# Altium schematic sheet 13_Raspberry_Misc.SchDoc: Raspberry Misc
size A3; Organization: Lime Microsystems; Address1: Surrey Tech Centre; Address2: Guildford GU2 7YG; Address3: Surrey; Address4: United Kingdom; DocumentNumber: 12; Revision: v2.1; SheetNumber: 13; SheetTotal: 15; PageSetup: Record=PageOptions|CenterHorizontal=True|CenterVertical=True|PrintScale=1.01|XCorrection=1.00|YCorrection=1.00|PrintKind=0|BorderSize=5000000|LeftOffset=0|BottomOffset=0|Orientation=2|PaperLength=1000|PaperWidth=1000|Scale=100|PaperSource=257|PrintQuality=600|MediaType=1|DitherType=10|PrintScaleMode=1|PaperKind=A3|PaperIndex=8
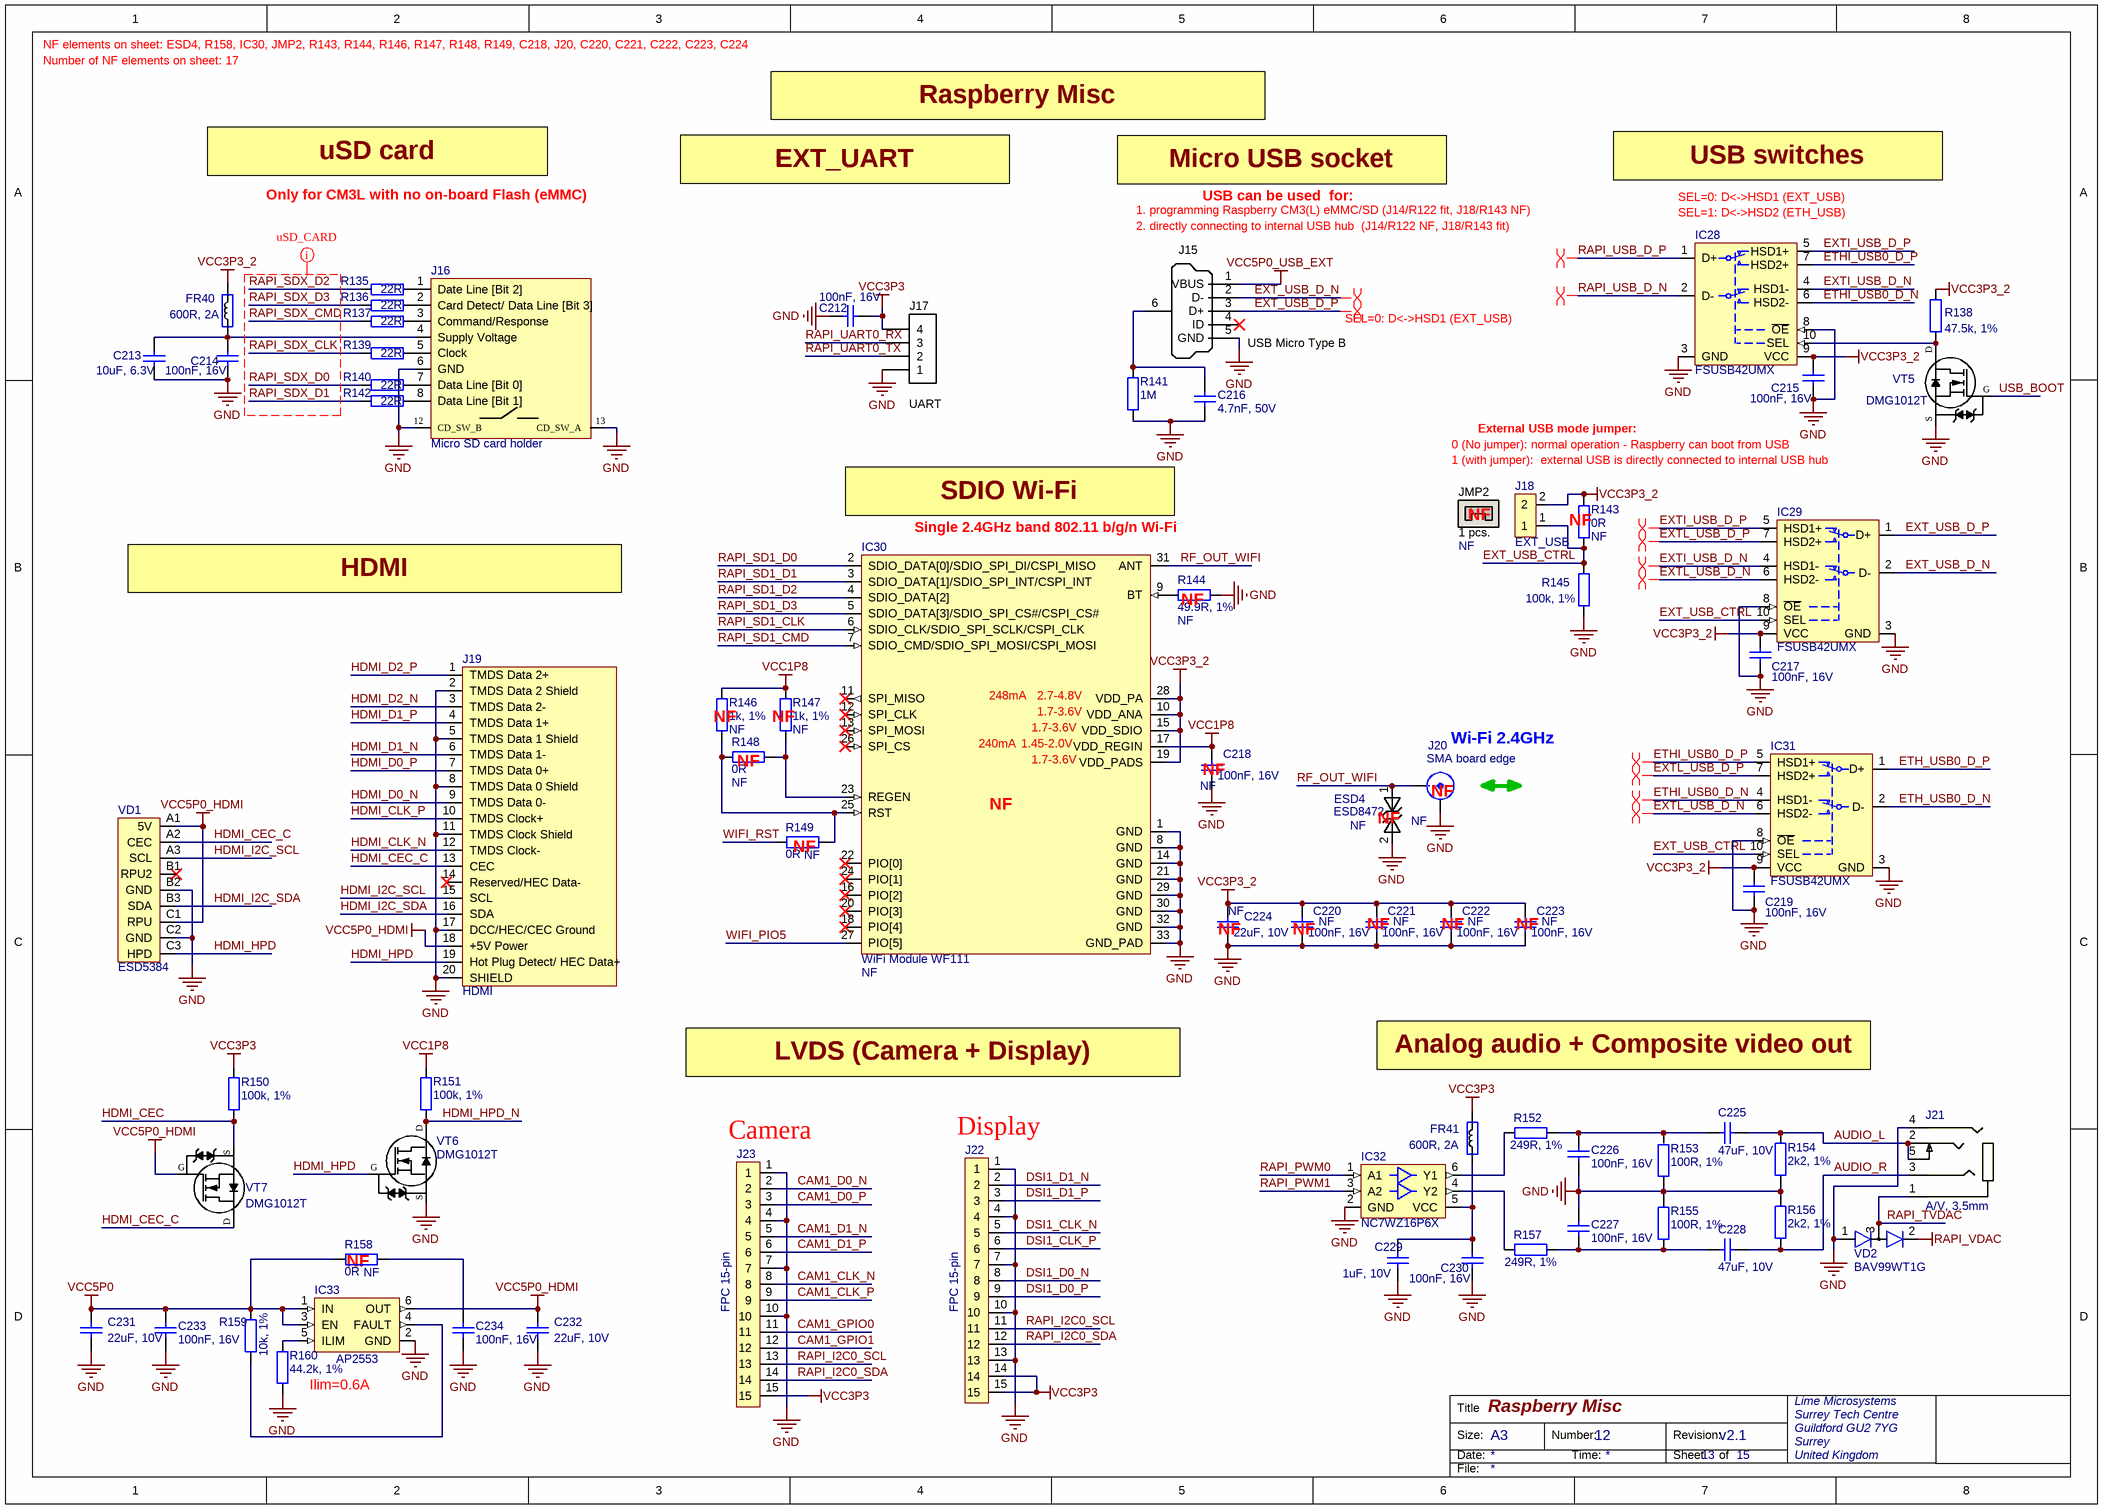
[diagram p0: 13_Raspberry_Misc.SchDoc]

## Parts
C212  100nF, 16V  [CAP0402]
C213  10uF, 6.3V  [CAP0603]
C214  100nF, 16V  [CAP0402]
C215  100nF, 16V  [CAP0402]
C216  4.7nF, 50V  [CAP0402]
C217  100nF, 16V  [CAP0402]
C218  100nF, 16V  Assembly Info: NF  [CAP0402]
C219  100nF, 16V  [CAP0402]
C220  100nF, 16V  Assembly Info: NF  [CAP0402]
C221  100nF, 16V  Assembly Info: NF  [CAP0402]
C222  100nF, 16V  Assembly Info: NF  [CAP0402]
C223  100nF, 16V  Assembly Info: NF  [CAP0402]
C224  22uF, 10V  Assembly Info: NF  [CAP0603]
C225  47uF, 10V  [CAP1206]
C226  100nF, 16V  [CAP0402]
C227  100nF, 16V  [CAP0402]
C228  47uF, 10V  [CAP1206]
C229  1uF, 10V  [CAP0402]
C230  100nF, 16V  [CAP0402]
C231  22uF, 10V  [CAP0603]
C232  22uF, 10V  [CAP0603]
C233  100nF, 16V  [CAP0402]
C234  100nF, 16V  [CAP0402]
ESD4  ESD8472  Assembly Info: NF  [ESD8472_X3DFN2]
FR40  600R, 2A  [RES0805]
FR41  600R, 2A  [RES0805]
IC28  FSUSB42UMX  [FSUSB42UMX]
IC29  FSUSB42UMX  [FSUSB42UMX]
IC30  WiFi Module WF111  Assembly Info: NF  [WF111-A-V1_WIFI]
IC31  FSUSB42UMX  [FSUSB42UMX]
IC32  NC7WZ16P6X  [SC-70_NC7WZ16P6X]
IC33  AP2553  [SOT23-6]
J15  USB Micro Type B  [microUSB_v2]
J16  Micro SD card holder  [MICRO_SD_CARD_114-00841-68_v2]
J17  UART  [HEADER4X1_TH]
J18  EXT_USB  [HDR_1x2]
J19  HDMI  [HDMI_AMPHENOL_10029449-111RLF]
J20  SMA board edge  Assembly Info: NF  [SMA_connector_board_edge_SM]
J21  A/V, 3.5mm  [Audio_jack_3.5mm]
J22  FPC 15-pin  [FPC_CONNECTOR_15pin_1-1734248-5]
J23  FPC 15-pin  [FPC_CONNECTOR_15pin_1-1734248-5]
JMP2  1 pcs.  Assembly Info: NF  (mechanical)
R135  22R  [RES0402]
R136  22R  [RES0402]
R137  22R  [RES0402]
R138  47.5k, 1%  [RES0402]
R139  22R  [RES0402]
R140  22R  [RES0402]
R141  1M  [RES0402]
R142  22R  [RES0402]
R143  0R  Assembly Info: NF  [RES0402]
R144  49.9R, 1%  Assembly Info: NF  [RES0402]
R145  100k, 1%  [RES0402]
R146  1k, 1%  Assembly Info: NF  [RES0402]
R147  1k, 1%  Assembly Info: NF  [RES0402]
R148  0R  Assembly Info: NF  [RES0402]
R149  0R  Assembly Info: NF  [RES0402]
R150  100k, 1%  [RES0402]
R151  100k, 1%  [RES0402]
R152  249R, 1%  [RES0402]
R153  100R, 1%  [RES0402]
R154  2k2, 1%  [RES0402]
R155  100R, 1%  [RES0402]
R156  2k2, 1%  [RES0402]
R157  249R, 1%  [RES0402]
R158  0R  Assembly Info: NF  [RES0402_v2]
R159  10k, 1%  [RES0402]
R160  44.2k, 1%  [RES0402]
VD1  ESD5384  [TVS_ESD5384NCTBG]
VD2  BAV99WT1G  [SC-70_BAV99WT1G]
VT5  DMG1012T  [SOT523]
VT6  DMG1012T  [SOT523]
VT7  DMG1012T  [SOT523]

## Nets
GND: C212.2 C213.1 C214.2 C215.2 C216.2 C217.2 C218.1 C219.2 C220.1 C221.1 C222.1 C223.1 C224.1 C226.2 C227.1 C229.1 C230.2 C231.1 C232.1 C233.2 C234.2 ESD4.2 IC28.3(GND) IC28.8(~{OE}) IC29.3(GND) IC29.8(~{OE}) IC30.1(GND) IC30.8(GND) IC30.14(GND) IC30.21(GND) IC30.29(GND) IC30.30(GND) IC30.32(GND) IC30.33(GND_PAD) IC31.3(GND) IC31.8(~{OE}) IC32.2(GND) IC33.2(GND) J15.5(GND) J16.6(GND) J16.12(CD_SW_B) J16.13(CD_SW_A) J17.1 J19.2(TMDS_Data_2_Shield) J19.5(TMDS_Data_1_Shield) J19.8(TMDS_Data_0_Shield) J19.11(TMDS_Clock_Shield) J19.17(DCC/HEC/CEC_Ground) J19.20(SHIELD) J20.2(Y) J21.4 J22.1 J22.4 J22.7 J22.10 J22.13 J23.1 J23.4 J23.7 J23.10 R141.2 R144.1 R145.2 R153.1 R154.2 R155.2 R156.1 R160.2 VD1.B2(GND) VD1.C2(GND) VD2.1 VT5.S VT6.S
RAPI_VDAC: VD2.2
VCC1P8: C218.2 IC30.17(VDD_REGIN) R146.1 R147.1 R151.1
VCC3P3: C212.1 FR41.2 J17.4 J22.14 J22.15 J23.15 R150.1
VCC3P3_2: C215.1 C217.1 C219.1 C220.2 C221.2 C222.2 C223.2 C224.2 FR40.2 IC28.9(VCC) IC29.9(VCC) IC30.10(VDD_ANA) IC30.15(VDD_SDIO) IC30.19(VDD_PADS) IC30.28(VDD_PA) IC31.9(VCC) J18.2 R138.1 R143.2
VCC5P0: C231.2 C233.1 IC33.1(IN) IC33.3(EN) R158.2 R159.1
VCC5P0_HDMI: C232.2 C234.1 IC33.6(OUT) J19.18(+5V_Power) R158.1 VD1.A1(5V) VD1.C1(RPU) VT7.G
VCC5P0_USB_EXT: J15.1(VBUS)
AUDIO_L: C225.1 J21.2 J21.5 R154.1
AUDIO_R: C228.1 J21.3 R156.2
CAM1_CLK_N: J23.8
CAM1_CLK_P: J23.9
CAM1_D0_N: J23.2
CAM1_D0_P: J23.3
CAM1_D1_N: J23.5
CAM1_D1_P: J23.6
CAM1_GPIO0: J23.11
CAM1_GPIO1: J23.12
DSI1_CLK_N: J22.5
DSI1_CLK_P: J22.6
DSI1_D0_N: J22.8
DSI1_D0_P: J22.9
DSI1_D1_N: J22.2
DSI1_D1_P: J22.3
ETH_USB0_D_N: IC31.2(D-)
ETH_USB0_D_P: IC31.1(D+)
ETHI_USB0_D_N: IC28.6(HSD2-) IC31.4(HSD1-)
ETHI_USB0_D_P: IC28.7(HSD2+) IC31.5(HSD1+)
EXT_USB_CTRL: IC29.10(SEL) IC31.10(SEL) J18.1 R143.1 R145.1
EXT_USB_D_N: IC29.2(D-) J15.2(D-)
EXT_USB_D_P: IC29.1(D+) J15.3(D+)
EXTI_USB_D_N: IC28.4(HSD1-) IC29.4(HSD1-)
EXTI_USB_D_P: IC28.5(HSD1+) IC29.5(HSD1+)
EXTL_USB_D_N: IC29.6(HSD2-) IC31.6(HSD2-)
EXTL_USB_D_P: IC29.7(HSD2+) IC31.7(HSD2+)
HDMI_CEC: R150.2 VT7.S
HDMI_CEC_C: J19.13(CEC) VD1.A2(CEC) VT7.D
HDMI_CLK_N: J19.12(TMDS_Clock-)
HDMI_CLK_P: J19.10(TMDS_Clock+)
HDMI_D0_N: J19.9(TMDS_Data_0-)
HDMI_D0_P: J19.7(TMDS_Data_0+)
HDMI_D1_N: J19.6(TMDS_Data_1-)
HDMI_D1_P: J19.4(TMDS_Data_1+)
HDMI_D2_N: J19.3(TMDS_Data_2-)
HDMI_D2_P: J19.1(TMDS_Data_2+)
HDMI_HPD: J19.19(Hot_Plug_Detect/_HEC_Data+) VD1.C3(HPD) VT6.G
HDMI_HPD_N: R151.2 VT6.D
HDMI_I2C_SCL: J19.15(SCL) VD1.A3(SCL)
HDMI_I2C_SDA: J19.16(SDA) VD1.B3(SDA)
RAPI_I2C0_SCL: J22.11 J23.13
RAPI_I2C0_SDA: J22.12 J23.14
RAPI_PWM0: IC32.1(A1)
RAPI_PWM1: IC32.3(A2)
RAPI_SD1_CLK: IC30.6(SDIO_CLK/SDIO_SPI_SCLK/CSPI_CLK)
RAPI_SD1_CMD: IC30.7(SDIO_CMD/SDIO_SPI_MOSI/CSPI_MOSI)
RAPI_SD1_D0: IC30.2(SDIO_DATA[0]/SDIO_SPI_DI/CSPI_MISO)
RAPI_SD1_D1: IC30.3(SDIO_DATA[1]/SDIO_SPI_INT/CSPI_INT)
RAPI_SD1_D2: IC30.4(SDIO_DATA[2])
RAPI_SD1_D3: IC30.5(SDIO_DATA[3]/SDIO_SPI_CS#/CSPI_CS#)
RAPI_SDX_CLK: R139.1
RAPI_SDX_CMD: R137.1
RAPI_SDX_D0: R140.1
RAPI_SDX_D1: R142.1
RAPI_SDX_D2: R135.1
RAPI_SDX_D3: R136.1
RAPI_TVDAC: J21.1 VD2.3
RAPI_UART0_RX: J17.3
RAPI_UART0_TX: J17.2
RAPI_USB_D_N: IC28.2(D-)
RAPI_USB_D_P: IC28.1(D+)
RF_OUT_WIFI: ESD4.1 IC30.31(ANT) J20.1(X)
USB_BOOT: VT5.G
WIFI_PIO5: IC30.27(PIO[5])
WIFI_RST: R149.1
NetC213_2: C213.2 C214.1 FR40.1 J16.4(Supply_Voltage)
NetC216_1: C216.1 J15.6(Shell) R141.1
NetC225_2: C225.2 C226.1 R152.2 R153.2
NetC227_2: C227.2 C228.2 R155.1 R157.2
NetC229_2: C229.2 C230.1 FR41.1 IC32.5(VCC)
NetIC28_10: IC28.10(SEL) R138.2 VT5.D
NetIC30_9: IC30.9(BT) R144.2
NetIC30_23: IC30.23(REGEN) R147.2 R148.2
NetIC30_25: IC30.25(RST) R146.2 R148.1 R149.2
NetIC32_4: IC32.4(Y2) R157.1
NetIC32_6: IC32.6(Y1) R152.1
NetIC33_4: IC33.4(FAULT) R159.2
NetIC33_5: IC33.5(ILIM) R160.1
NetJ16_1: J16.1(Date_Line_[Bit_2]) R135.2
NetJ16_2: J16.2(Card_Detect/_Data_Line_[Bit_3]) R136.2
NetJ16_3: J16.3(Command/Response) R137.2
NetJ16_5: J16.5(Clock) R139.2
NetJ16_7: J16.7(Data_Line_[Bit_0]) R140.2
NetJ16_8: J16.8(Data_Line_[Bit_1]) R142.2

Not connected (* = marked no-connect by the designer): IC30 11(SPI_MISO)* 12(SPI_CLK)* 13(SPI_MOSI)* 16(PIO[2])* 18(PIO[4])* 20(PIO[3])* 22(PIO[0])* 24(PIO[1])* 26(SPI_CS)*; J15 4(ID)*; J19 14(Reserved/HEC_Data-)*; JMP2 1 2; VD1 B1(RPU2)*

## Layout directives
net class uSD_CARD: RAPI_SDX_CLK, RAPI_SDX_CMD, RAPI_SDX_D0, RAPI_SDX_D1, RAPI_SDX_D2, RAPI_SDX_D3
differential pair: ETHI_USB0_D_N, ETHI_USB0_D_P, EXT_USB_D_N, EXT_USB_D_P, EXTI_USB_D_N, EXTI_USB_D_P, EXTL_USB_D_N, EXTL_USB_D_P, RAPI_USB_D_N, RAPI_USB_D_P

## Notes on the sheet
- Number of NF elements on sheet: 17
- NF elements on sheet: ESD4, R158, IC30, JMP2, R143, R144, R146, R147, R148, R149, C218, J20, C220, C221, C222, C223, C224
- Raspberry Misc
- uSD card
- EXT_UART
- Micro USB socket
- USB switches
- Only for CM3L with no on-board Flash (eMMC)
- (near J15) 2. directly connecting to internal USB hub  (J14/R122 NF, J18/R143 fit)
- 1. programming Raspberry CM3(L) eMMC/SD (J14/R122 fit, J18/R143 NF)
- USB can be used  for:
- (near IC28) SEL=0: D<->HSD1 (EXT_USB)
- (near IC28) SEL=1: D<->HSD2 (ETH_USB)
- SEL=0: D<->HSD1 (EXT_USB)
- 0 (No jumper): normal operation - Raspberry can boot from USB
- External USB mode jumper:
- SDIO Wi-Fi
- 1 (with jumper):  external USB is directly connected to internal USB hub
- (near JMP2) NF
- HDMI
- (near IC30) Single 2.4GHz band 802.11 b/g/n Wi-Fi
- (near R143) NF
- (near R144) NF
- (near R146) NF
- (near R147) NF
- (near IC30) 248mA
- (near IC30) 2.7-4.8V
- (near IC30) 1.7-3.6V
- (near R148) NF
- (near IC30) 240mA
- (near IC30) 1.45-2.0V
- (near C218) NF
- (near J20) Wi-Fi 2.4GHz
- (near R149) NF
- (near IC30) NF
- (near ESD4) NF
- (near J20) NF
- (near C221) NF
- (near C222) NF
- (near C223) NF
- (near C224) NF
- (near C220) NF
- LVDS (Camera + Display)
- Analog audio + Composite video out
- (near J23) Camera
- (near J22) Display
- (near R158) NF
- Ilim=0.6A
- Title
- Size:
- Date:
- A3
- Number:
- Time:
- Revision:
- Sheet
- of
- File:

## Library data of the parts
C212 C214 = Cap_0603: Manufacturer Part Number 1: GRM155R71C104KA88D; Part Description: CAP CER 0.1UF 16V X7R 0402; Brand: Murata Electronics; Tolerance: 10 %; Type: General Purpose MLCC; Capacitance: 0.1 uF; Temperature Coefficient / Code: +/- 15 %; Supplier 1: Mouser; Supplier Part Number 1: 81-GRM155R71C104KA88; Case Code - in: 0402; Manufacturer: Murata Electronics; Category: Multilayer Ceramic Capacitors MLCC - SMD/SMT; Voltage Rating DC: 16 V; Value: 100nF, 16V; Maximum Operating Temperature: + 125 C; Minimum Operating Temperature: - 55 C; Minimum Order Quantity: 1; Operating Temperature Range: - 55 C to + 125 C; Package / Case: 0402 (1005 metric); Packaging: Reel; Product: General Type MLCCs; Product Category: Low & Medium Capacitance SMD Ceramic Chip Capacitors; Reeling: True; RoHS - Mouser: Y; RoHS: RoHS Compliant; Series: GRM; Standard Pack Qty: 10000; Termination Style: SMD/SMT
C213 = Cap_0603: Manufacturer Part Number 1: CC0603MRX5R5BB106; Manufacturer: Yageo; Part Description: 10µF ±20% 6.3V X5R Ceramic Capacitor -55°C ~ 85°C Surface Mount, MLCC 0603 (1608 Metric) 0.063" L x 0.031" W (1.60mm x 0.80mm); Capacitance: 10µF; Tolerance: ±20%; Supplier 1: Digi-Key; Supplier Part Number 1: 311-1448-2-ND; Package / Case: 0603 (1608 Metric); Category: Capacitors; Voltage - Rated: 6.3V; Value: 10uF, 6.3V
C215 C217-C223 C226 C227 C230 C233 C234 = Cap_0402: Manufacturer: Murata Electronics; Manufacturer Part Number: GRM155R71C104KA88D; Part Description: CAP CER 0.1UF 16V X7R 0402; Tolerance: 10 %; Type: General Purpose MLCC; Capacitance: 0.1 uF; Case Length: 1 mm; Dielectric: X7R; Case Height: 0.5 mm; Temperature Coefficient / Code: +/- 15 %; Value: 100nF, 16V; Supplier 1: Mouser; Supplier Part Number 1: 81-GRM155R71C104KA88; Case Code - in: 0402; RoHS: RoHS Compliant; Operating Temperature Range: - 55 C to + 125 C; Series: GRM; Termination Style: SMD/SMT; Package / Case: 0402 (1005 metric); Voltage Rating DC: 16 V; Maximum Operating Temperature: + 125 C; Case Code - mm: 1005; Minimum Operating Temperature: - 55 C; Product Category: Low & Medium Capacitance SMD Ceramic Chip Capacitors; Packaging: Reel; Product: General Type MLCCs; Category: Multilayer Ceramic Capacitors MLCC - SMD/SMT; Brand: Murata Electronics; Case Width: 0.5 mm; RoHS - Mouser: Y; Standard Pack Qty: 10000; Minimum Order Quantity: 1; Reeling: True; Manufacturer Part Number 1: GRM155R71C104KA88D
C216 = Cap_0402: Manufacturer: Murata Electronics North America; Manufacturer Part Number 1: GCM155R71H472KA37D; Part Description: 4700pF ±10% 50V Ceramic Capacitor X7R 0402 (1005 Metric); Tolerance: ±10%; Temperature Coefficient: X7R; Voltage - Rated: 50V; Packaging: Cut Tape (CT); Operating Temperature: -55°C ~ 125°C; Package / Case: 0402 (1005 Metric); Thickness (Max): 0.022" (0.55mm); Features: -; Supplier Part Number 1: 490-4915-1-ND; Ratings: AEC-Q200; Applications: Automotive; Size / Dimension: 0.039" L x 0.020" W (1.00mm x 0.50mm); Part Status: Active; Lead Spacing: -; Lead Style: -; Supplier 1: Digi-Key; Height - Seated (Max): -; Mounting Type: Surface Mount, MLCC; RoHS: RoHS Compliant; Category: Capacitors; Value: 4.7nF, 50V
C224 C231 C232 = Cap_0603: Manufacturer Part Number 1: C1608X5R1A226M080AC; Manufacturer: TDK Corporation; Part Description: 22µF ±20% 10V X5R Ceramic Capacitor -55°C ~ 85°C Surface Mount, MLCC 0603 (1608 Metric) 0.063" L x 0.031" W (1.60mm x 0.80mm); Brand: TDK; Temperature Coefficient / Code: +/- 15 %; Tolerance: 20 %; Type: Multilayer Ceramic Chip Capacitor; Supplier 1: Mouser; Supplier Part Number 1: 810-C1608X5R1A226M; Package / Case: 0603 (1608 metric); Category: Multilayer Ceramic Capacitors MLCC - SMD/SMT; Capacitance: 22 uF; Operating Temperature Range: - 55 C to + 85 C; Case Code - in: 0603; Voltage Rating DC: 10 V; Case Code - mm: 1608; Value: 22uF, 10V
C225 C228 = Cap_1206: Manufacturer: TDK Corporation; Manufacturer Part Number 1: C3216X6S1A476M160AC; Part Description: 47µF ±20% 10V Ceramic Capacitor X6S 1206 (3216 Metric); Notification: Current market demand for these product types have resulted in fluctuating and extending lead times. Lead times may differ.; Tolerance: ±20%; Temperature Coefficient: X6S; Value: 47uF, 10V; RoHS: RoHS Compliant; Packaging: Cut Tape (CT); Operating Temperature: -55°C ~ 105°C; Voltage - Rated: 10V; Height - Seated (Max): -; Ratings: -; Applications: General Purpose; Features: Low ESL; Size / Dimension: 0.126" L x 0.063" W (3.20mm x 1.60mm); Supplier 1: Digi-Key; Lead Spacing: -; Supplier Part Number 1: 445-6010-1-ND; Thickness (Max): 0.071" (1.80mm); Failure Rate: -; Category: Capacitors; Lead Style: -; Part Status: Active; Mounting Type: Surface Mount, MLCC; Package / Case: 1206 (3216 Metric)
C229 = Cap_0402: CAP CER 1UF 10V X5R 0402; Manufacturer: Yageo; Part Description: 1µF 10V Ceramic Capacitor X5R 0402 (1005 Metric) 0.039" L x 0.020" W (1.00mm x 0.50mm); Manufacturer Part Number 1: CC0402MRX5R6BB105; Notification: Current market demand for these product types have resulted in fluctuating and extending lead times. Lead times may differ.; Tolerance: ±20%; Value: 1uF, 10V; Supplier 1: Digi-Key; Supplier Part Number 1: 311-1732-1-ND; RoHS: RoHS Compliant; Applications: General Purpose; Category: Capacitors; ComponentLink1Description: http://www.yageo.com/documents/recent/UPY-GPHC_X5R_4V-to-50V_25.pdf; ComponentLink1URL: http://www.yageo.com/documents/recent/UPY-GPHC_X5R_4V-to-50V_25.pdf; Failure Rate: -; Features: -; Height - Seated (Max): -; Lead Spacing: -; Lead Style: -; Mounting Type: Surface Mount, MLCC; Operating Temperature: -55°C ~ 85°C; Package / Case: 0402 (1005 Metric); Packaging: Cut Tape (CT); Part Status: Active; Pricing 1: 1=0.22, 10=0.156, 100=0.0732, 500=0.0513, 1000=0.04248, 2500=0.03953, 5000=0.03617 (USD); Ratings: -; Size / Dimension: 0.039" L x 0.020" W (1.00mm x 0.50mm); Stock 1: 69600; Temperature Coefficient: X5R; Thickness (Max): 0.022" (0.55mm); Voltage - Rated: 10V
ESD4 = ESD8472: Manufacturer: ON Semiconductor; Manufacturer Part Number 1: ESD8472MUT5G; Part Description: TVS DIODE 5.3VWM 14VC X3DFN2; Voltage - Reverse Standoff (Typ): 5.3V (Max); Voltage - Breakdown (Min): 7V; Voltage - Clamping (Max) @ Ipp: 14V; Current - Peak Pulse (10/1000µs): 3A (8/20µs); Power Line Protection: No; Capacitance @ Frequency: 0.2pF @ 1MHz; Supplier 1: Digi-Key; RoHS: RoHS Compliant; Category: Circuit Protection; Stock 1: 2295; Pricing 1: 1=0.39, 10=0.315, 100=0.2142, 500=0.16068, 1000=0.12051 (USD); Packaging: Cut Tape (CT); Part Status: Active; Type: Zener; Power - Peak Pulse: -; Applications: Automotive, RF Antenna; Operating Temperature: -55°C ~ 150°C (TJ); Mounting Type: Surface Mount; Package / Case: 2-XFDFN; Supplier Device Package: 2-X3DFN (0.62x0.32); ComponentLink1URL: http://www.onsemi.com/pub/Collateral/ESD8472-D.PDF; ComponentLink1Description: http://www.onsemi.com/pub/Collateral/ESD8472-D.PDF; Supplier Part Number 1: ESD8472MUT5GOSCT-ND
FR40 FR41 = Ferrite: Manufacturer Part Number 1: MPZ2012S601AT000; Manufacturer: TDK Corporation; Part Description: FERRITE BEAD 600 OHM 0805 1LN; Filter Type: Differential Mode - Single; Impedance @ Frequency: 600 Ohm @ 100MHz; DC Resistance (DCR): 100 mOhm Max; Supplier 1: Digi-Key; Supplier Part Number 1: 445-2206-2-ND; Mounting Type: Surface Mount; RoHS: RoHS Compliant; Height (Max): 0.041" (1.05mm); Packaging: Tape & Reel (TR); Category: Filters; Current Rating: 2A; Package / Case: 0805 (2012 Metric); Size / Dimension: 0.079" L x 0.049" W (2.00mm x 1.25mm)
IC28 IC29 IC31 = FSUSB42UMX: Part Description: USB Switch IC 1 Channel 10-UMLP (1.8x1.4); Manufacturer: ON Semiconductor; Switch Circuit: DPDT; On-State Resistance (Max): 6.5 Ohm; Voltage - Supply, Single (V+): 2.4 V ~ 4.4 V; -3db Bandwidth: 720MHz; Supplier 1: Digi-Key; Manufacturer Part Number 1: FSUSB42UMX; RoHS: RoHS Compliant; Category: Integrated Circuits (ICs); Stock 1: 8344; Pricing 1: 1=0.59, 10=0.502, 100=0.3749, 500=0.29458, 1000=0.22763 (USD); Packaging: Cut Tape (CT); Part Status: Active; Applications: USB; Multiplexer/Demultiplexer Circuit: -; Voltage - Supply, Dual (V±): -; Features: Break-Before-Make, USB 2.0; Operating Temperature: -40°C ~ 85°C (TA); Package / Case: 10-UFQFN; Supplier Device Package: 10-UMLP (1.8x1.4); Base Part Number: FSUSB42; ComponentLink1URL: https://www.fairchildsemi.com/datasheets/FS/FSUSB42.pdf; ComponentLink1Description: https://www.fairchildsemi.com/datasheets/FS/FSUSB42.pdf; Supplier Part Number 1: FSUSB42UMXCT-ND
IC30 = WF111-A-V1_WIFI: Manufacturer: Bluegiga Technologies; Part Description: RF TXRX MODULE WIFI CHIP ANT; Data Rate: 72200Kbps; Number of Channels: 13; Operating Supply Voltage: 3.3V; Max Frequency: 2.472GHz; Supplier 1: Digi-Key; Manufacturer Part Number 1: WF111-A-V1; Stock 1: 1144; Pricing 1: 1=10.23, 25=9.8484, 100=9.4695 (USD); Mount: Surface Mount; Number of Pins: 33; Min Operating Temperature: -40°C; Max Operating Temperature: 85°C; Supplier Part Number 1: 1446-1031-6-ND
IC32 = NC7WZ16P6X_DUAL_BUFFER: Manufacturer: ON Semiconductor / Fairchild; Part Description: Buffer, Non-Inverting 2 Element 1 Bit per Element Push-Pull Output SC-70-6; Min Supply Voltage: 1.65V; Max Supply Voltage: 5.5V; Number of Channels: 2; Propagation Delay: 3.8ns; Logic Function: Buffer,Inverting; Max Power Dissipation: 180mW; Low Level Output Current: 32mA; Polarity: Non-Inverting; Number of Bits per Element: 1; High Level Output Current: -32mA; Turn-On Delay Time: 10.6ns; Quiescent Current: 1uA; Supplier 1: Digi-Key; Manufacturer Part Number 1: NC7WZ16P6X; Stock 1: 0; Mount: Surface Mount; Case/Package: SC; Number of Pins: 6; Weight: 0.028g; Contact Plating: Matte,Tin; Min Operating Temperature: -40°C; Max Operating Temperature: 125°C; Number of Inputs: 2; Number of Outputs: 2; Packaging: Tape and Reel; Package Quantity: 3000; Number of Elements: 2; Number of Input Lines: 2; Number of Output Lines: 2; Termination: SMD/SMT; Number of Circuits: 2; Number of Bits: 2; Length: 2mm; Height: 1mm; Width: 1.25mm; Radiation Hardening: No; REACH SVHC: No SVHC; Lead Free: Lead Free; Supplier Part Number 1: NC7WZ16P6XDKR-ND
IC33 = AP2553W6-7: Manufacturer: Diodes; Part Description: IC PD SW CURR LIMIT SOT26; Number of Outputs: 1; Min Supply Voltage: 2.7V; Max Supply Voltage: 5.5V; Interface: On/Off; Max Output Current: 2.1A; Turn-Off Delay Time: 500us; On-State Resistance: 70mR; Turn-On Delay Time: 1.5ms; Power Rating: 340mW; Fault Protection: Over Temperature,Reverse Current; Output Configuration: High Side; Supplier 1: Digi-Key; Manufacturer Part Number 1: AP2553W6-7; Stock 1: 53805; Pricing 1: 1=0.5, 10=0.425, 100=0.3172, 500=0.24926, 1000=0.19261 (USD); Mount: Surface Mount; Case/Package: SOT-26; Number of Pins: 6; Min Operating Temperature: -40°C; Max Operating Temperature: 85°C; Package Quantity: 3000; Packaging: Tape and Reel; Voltage: 5.5V; Current: 2.1A; Length: 3.1mm; Height: 1.3mm; Width: 1.7mm; Radiation Hardening: No; Lead Free: Lead Free; REACH SVHC: No SVHC; Supplier Part Number 1: AP2553W6-7DIDKR-ND
J15 = USB_Micro_TypeB: Connector SMD USB Micro Type B; Part Description: CONN USB MICRO B RECPT SMT R/A; Manufacturer Part Number 1: 10118193-0001LF; Manufacturer: Amphenol FCI; Connector Type: USB - micro B; Number of Contacts: 5; Supplier 1: Digi-Key; Category: Connectors, Interconnects; Mounting Type: Surface Mount, Right Angle, Horizontal; Supplier Part Number 1: 609-4616-2-ND
J16 = MICRO_SD_114-00841-68: Manufacturer: Amphenol Commercial Products; Part Description: 10 (8 + 2) Position Card Connector Secure Digital - microSD™ Surface Mount, Right Angle Gold; Card Type: Secure Digital - microSD™; Number of Positions: 10 (8 + 2); Connector Type: Connector; Insertion, Removal Method: Push In, Pull Out; Supplier 1: Digi-Key; Manufacturer Part Number 1: 114-00841-68; RoHS: RoHS Compliant; Category: Connectors, Interconnects; Stock 1: 5866; Pricing 1: 1=1.5, 10=1.358, 25=1.2752, 50=1.2196, 100=1.1642, 250=1.05336, 500=0.9702 (USD); Packaging: Cut Tape (CT); Part Status: Active; Ejector Side: -; Mounting Type: Surface Mount, Right Angle; Features: Switch; Height Above Board: 0.061" (1.55mm); Mounting Feature: Normal, Standard - Top; Contact Finish: Gold; Contact Finish Thickness: 15.0µin (0.38µm); ComponentLink1URL: https://www.amphenolcanada.com/ProductSearch/drawings/AC/1140084168.pdf; ComponentLink1Description: https://www.amphenolcanada.com/ProductSearch/drawings/AC/1140084168.pdf; Supplier Part Number 1: 114-00841-68-1-ND
J17 = Header4P: Header, 4-pin; Part Description: 4 Positions Header Connector 0.100" (2.54mm) Through Hole Gold; Manufacturer: Wurth Electronics Inc.; Manufacturer Part Number 1: 61300411121; Pitch - Mating: 0.100" (2.54mm); Number of Positions: 4; Number of Positions Loaded: All; Style: Board to Board or Cable; Shrouding: Unshrouded; Contact Length - Mating: 0.236" (6.00mm); Contact Length - Post: 0.118" (3.00mm); Overall Contact Length: 0.454" (11.54mm); Material Flammability Rating: UL94 V-0; Current Rating: 3A; Voltage Rating: 250V; Supplier 1: Digi-Key; Supplier Part Number 1: 732-5317-ND; RoHS: RoHS Compliant; Category: Connectors, Interconnects; Stock 1: 25204; Pricing 1: 1=0.18, 10=0.153, 25=0.1272, 50=0.106, 100=0.096, 1000=0.088 (USD); Packaging: Bulk; Part Status: Active; Connector Type: Header; Contact Type: Male Pin; Number of Rows: 1; Row Spacing - Mating: -; Mounting Type: Through Hole; Termination: Solder; Fastening Type: Push-Pull; Insulation Height: 0.100" (2.54mm); Contact Shape: Square; Contact Finish - Mating: Gold; Contact Finish Thickness - Mating: -; Contact Finish - Post: -; Contact Material: Copper Alloy; Insulation Material: Polybutylene Terephthalate (PBT); Features: -; Operating Temperature: -40°C ~ 125°C; Ingress Protection: -; Insulation Color: Black; Mated Stacking Heights: -; Contact Finish Thickness - Post: -; Applications: -; ComponentLink1URL: http://katalog.we-online.de/em/datasheet/6130xx11121.pdf; ComponentLink1Description: http://katalog.we-online.de/em/datasheet/6130xx11121.pdf
J18 = Jumper: Manufacturer Part Number 1: 961102-6404-AR; Part Description: 2 Positions Header, Unshrouded Connector 0.100" (2.54mm) Through Hole Gold; Manufacturer: 3M; Connector Type: Header, Unshrouded; Supplier 1: Digi-Key; Supplier Part Number 1: 3M9447-ND; Contact Type: Male Pin; Color: Black; Mounting Type: Through Hole; Category: Connectors, Interconnects; Contact Finish: Gold
J19 = HDMI_AMPHENOL_10029449-111RLF: Manufacturer: Amphenol FCI; Part Description: HDMI HDMI™ 1.4 Receptacle Connector 19 Position Surface Mount, Right Angle; Through Hole; Body Material: Stainless Steel; Gender: Receptacle; Voltage Rating: 40V; Number of Contacts: 19; Insulation Resistance: 100MR; Number of Ports: 1; Pitch: 0.5mm; Supplier 1: Mouser; Manufacturer Part Number 1: 10029449-111RLF; Stock 1: 4435; Pricing 1: 1=0.72, 10=0.661, 50=0.525, 100=0.503, 1000=0.367, 10000=0.325 (USD); Mount: Horizontal,Surface Mount; Contact Material: Bronze,Copper Alloy; Contact Plating: Gold; Colour: Black; Number of Terminals: 19; Housing Material: Thermoplastic; Min Operating Temperature: -55°C; Max Operating Temperature: 85°C; Package Quantity: 400; Packaging: Tape and Reel; Connector Type: HDMI; Number of Positions: 19; Termination: Solder; Max Voltage Rating (AC): 40V; Orientation: Right Angle; Features: Shielded; Length: 15.7mm; Depth: 9.5mm; Radiation Hardening: No; REACH SVHC: No SVHC; Lead Free: Lead Free; Supplier Part Number 1: 649-10029449-111RLF
J20 = RF_IF_connector: CONN SMA JACK STR 50OHM EDGE MNT; Manufacturer: RF Solutions; Manufacturer Part Number 1: CON-SMA-EDGE-S; Part Description: SMA Connector Jack, Female Socket Board Edge, End Launch Solder; Connector Type: Jack, Female Socket; Contact Termination: Solder; Supplier 1: Digi-Key; Supplier Part Number 1: CON-SMA-EDGE-S-ND; RoHS: RoHS Compliant; Category: Connectors, Interconnects; Stock 1: 1751; Pricing 1: 1=2.1 (USD); Packaging: -; Part Status: Active; Connector Style: SMA; Shield Termination: Solder; Impedance: -; Mounting Type: Board Edge, End Launch; Mounting Feature: -; Cable Group: -; Fastening Type: Threaded; Frequency - Max: -; Features: -; Housing Color: -; Ingress Protection: -; Includes: -; Body Material: -; Body Finish: -; Center Contact Plating: -; Dielectric Material: -; Operating Temperature: -; Center Contact Material: -; Voltage Rating: -; Mating Cycles: -; Insertion Loss: -; ComponentLink1URL: http://media.digikey.com/pdf/Data%20Sheets/RF%20Solutions%20PDFs/CON-SMA-EDGE.pdf; ComponentLink1Description: http://media.digikey.com/pdf/Data%20Sheets/RF%20Solutions%20PDFs/CON-SMA-EDGE.pdf
J21 = AUDIO_JACK_3mm5_SJ-4351X: Manufacturer: CUI Inc.; Manufacturer Part Number 1: SJ-43515TS; Part Description: CONN JACK 4COND 3.5MM R/A; Connector Type: Phone Jack; Gender: Female; Signal Lines: Multiple; Industry Recognized Mating Diameter: 3.50mm (0.141", 1/8", Mini Plug) - Headphone; Actual Diameter: 0.142" (3.60mm); Number of Positions/Contacts: 4 Conductors, 5 Contacts; Internal Switch(s): Single Switch; Shielding: Unshielded; Voltage - Rated: 12VDC; Current Rating: 1A; Mating Length/Depth: 0.551" (14.00mm); Body Color: Black; Supplier 1: Digi-Key; RoHS: RoHS Compliant; Category: Connectors, Interconnects; Stock 1: 62424; Pricing 1: 1=1.04, 10=0.91, 25=0.8568, 50=0.8212, 100=0.7854, 250=0.714, 500=0.6426, 1000=0.5712, 2500=0.51765 (USD); Packaging: Bulk; Part Status: Active; Mounting Type: Through Hole, Right Angle; Termination: Solder; Features: -; Insulation Color: -; Contact Material - Plating: Gold; Body Material: -; Includes: -; Housing Material: Polyamide (PA66), Nylon 6/6; Contact Material: Brass, Copper Alloy, Phosphor Bronze; Cable Opening: -; Panel Hole Size: -; Thread Size: -; Operating Temperature: -20°C ~ 85°C; ComponentLink1URL: http://www.cui.com/product/resource/digikeypdf/sj-4351x.pdf; ComponentLink1Description: http://www.cui.com/product/resource/digikeypdf/sj-4351x.pdf; Supplier Part Number 1: CP-43515TS-ND
J22 J23 = FPC_CONNECTOR_15pin_1-1734248-5: Manufacturer: TE Connectivity; Part Description: 15 Position FPC Connector Contacts, Vertical, 1 Sided 0.039" (1.00mm) Surface Mount; Current Rating: 1A; Voltage Rating: 125V; Gender: Receptacle; Number of Positions: 15; Shielding: Unshielded; Connector Type: Connector,Receptacle,Socket; Wire/Cable Type: Flat Flex; Connector System: Flex-to-Board; Mating Alignment: Yes (With); PCB Mount Alignment: No (Without); PCB Mount Retention: With; Circuit Application: Signal; Pitch: 1mm; Supplier 1: Digi-Key; Manufacturer Part Number 1: 1-1734248-5; Stock 1: 11808; Pricing 1: 1=1.03, 10=0.909, 25=0.8556, 50=0.82, 100=0.7843, 250=0.713, 500=0.6417 (USD); Mount: Surface Mount; Contact Plating: Gold; Contact Material: Bronze; Housing Colour: Black; Housing Material: Thermoplastic; Min Operating Temperature: -4°C; Max Operating Temperature: 185°C; Package Quantity: 1000; Packaging: Tape and Reel; Number of Rows: 1; Termination: SMD/SMT; Number of Contacts: 15; Orientation: Straight; Sealable: No (Without); Shrouded: Yes (With); Contact Current Rating: 1A; Length: 22.4mm; Height: 7.7mm; Width: 4.6mm; Depth: 4.6mm; REACH SVHC: Unknown; ELV: Compliant; Flammability Rating: UL94 V-0; Supplier Part Number 1: A101418DKR-ND
JMP2 = JUMP_2P_CONN_HEADER: Shorting Jumper, 2-position, 1.27mm pitch; Part Description: 2 (1 x 2) Position Shunt Connector Black Closed Top 0.100" (2.54mm) Gold; Manufacturer: Sullins; Manufacturer Part Number 1: SPC02SYAN; Number of Positions: 2; Pitch: 0.1inch; Supplier 1: Digi-Key; Supplier Part Number 1: S9001-ND; Stock 1: 570741; Pricing 1: 1=0.1, 10=0.059, 25=0.044, 50=0.0378, 100=0.0365, 250=0.03152, 500=0.03024, 1000=0.02646, 2500=0.02394 (USD); Colour: Black; Contact Plating: Gold; Package Quantity: 1000; Packaging: Bulk; Height: 0.256inch; Lead Free: Lead Free; ComponentLink1URL: http://www.sullinscorp.com/images/SPC02SYAN-0-3293.pdf; ComponentLink1Description: http://www.sullinscorp.com/images/SPC02SYAN-0-3293.pdf; ComponentLink2URL: https://drawings-pdf.s3.amazonaws.com/11134.pdf; ComponentLink2Description: https://drawings-pdf.s3.amazonaws.com/11134.pdf
R135-R137 R139 R140 R142 = Res_0402: Part Description: RES SMD 22 OHM 1% 1/16W 0402; Manufacturer Part Number 1: RC0402FR-0722RL; Manufacturer: Yageo; Tolerance: ±1%; Temperature Coefficient: ±100ppm/°C; Resistance (Ohms): 22; Supplier 1: Digi-Key; Supplier Part Number 1: 311-22.0LRTR-ND; Supplier Device Package: 0402; Composition: Thick Film; Category: Resistors; Value: 22R
R138 = Res_0402: Manufacturer Part Number 1: RC0402FR-0747K5L; Manufacturer: Yageo; Part Description: RES SMD 47.5K OHM 1% 1/16W 0402; Temperature Coefficient: ±100ppm/°C; Power (Watts): 0.063W, 1/16W; Value: 47.5k, 1%; Packaging: Cut Tape (CT); Composition: Thick Film; Supplier Part Number 1: 311-47.5KLRCT-ND; Supplier Device Package: 0402; Features: Moisture Resistant; Size / Dimension: 0.039" L x 0.020" W (1.00mm x 0.50mm); Package / Case: 0402 (1005 Metric); Operating Temperature: -55°C ~ 155°C; Height - Seated (Max): 0.016" (0.40mm); Supplier 1: Digi-Key; Part Status: Active; Resistance (Ohms): 47.5k; Failure Rate: -; Category: Resistors; Tolerance: ±1%; RoHS: RoHS Compliant
R141 = Res_0402: Manufacturer Part Number 1: CRG0402F1M0; Manufacturer: TE CONNECTIVITY; Part Description: RES SMD 1M OHM 1% 1/16W 0402; SVHC: No SVHC (16-Jun-2014; Product Range: CRG Series; Resistance: 1; Power Rating: 63; Resistor Case Style: 0402 [1005 Metric]; Resistor Element Material: Thick Film; Resistance Tolerance: ± 1%; Voltage Rating: 50; Temperature Coefficient: ± 100; Value: 1M; Supplier 1: Farnell; Supplier Part Number 1: 2331481; MSL: -; RoHS: YES; Packaging: Cut Tape
R143 R148 R149 R158 = Res_0402: Manufacturer Part Number 1: RC0402JR-070RL; Manufacturer: Yageo; Part Description: RES SMD 0.0OHM JUMPER 1/16W 0402; Resistance (Ohms): 0.0; Tolerance: Jumper; Power (Watts): 0.063W, 1/16W; Value: 0R; Supplier 1: Digi-Key; Supplier Part Number 1: 311-0.0JRTR-ND; Category: Resistors; Temperature Coefficient: -; Features: Moisture Resistant; Supplier Device Package: 0402; Height: 0.016" (0.40mm); Package / Case: 0402 (1005 Metric); Operating Temperature: -55°C ~ 155°C; Size / Dimension: 0.039" L x 0.020" W (1.00mm x 0.50mm); Composition: Thick Film; Packaging: Tape & Reel (TR); Number of Terminations: 2; RoHS: RoHS Compliant
R144 = Res_0402: Manufacturer: Samsung Electro-Mechanics America, Inc.; Part Description: RES SMD 49.9 OHM 1% 1/16W 0402; Manufacturer Part Number 1: RC1005F49R9CS; Temperature Coefficient: ±100ppm/°C; Resistance (Ohms): 49.9; Power (Watts): 0.063W, 1/16W; Number of Terminations: 2; Size / Dimension: 0.039" L x 0.020" W (1.00mm x 0.50mm); Supplier Device Package: 0402 (1005 Metric); RoHS: RoHS Compliant; Supplier Part Number 1: 1276-3469-6-ND; Features: -; Packaging: Digi-Reel®; Tolerance: ±1%; Height: 0.016" (0.40mm); Category: Resistors; Composition: Thick Film; Package / Case: 0402 (1005 Metric); Supplier 1: Digi-Key; Operating Temperature: -55°C ~ 155°C; Value: 49.9R, 1%
R145 R150 R151 = Res_0402: Manufacturer: Vishay Dale; Part Description: RES SMD 100K OHM 1% 1/10W 0402; Manufacturer Part Number 1: ERJ-2GEJ104X; Manufacturer Part Number: CRCW0402100KFKEDC; Power (Watts): 0.063W, 1/16W; Temperature Coefficient: ±100ppm/°C; Value: 100k, 1%; Supplier 1: Digi-Key; Supplier Part Number 1: 541-3960-1-ND; Category: Resistors; Size / Dimension: 0.039" L x 0.020" W (1.00mm x 0.50mm); Supplier Device Package: 0402; Composition: Thick Film; Number of Terminations: 2; RoHS: RoHS Compliant; Height: 0.016" (0.40mm); Operating Temperature: -55°C ~ 155°C; Features: Automotive AEC-Q200; Tolerance: ±1%; Packaging: Cut Tape (CT); Resistance (Ohms): 100k; Package / Case: 0402 (1005 Metric); Failure Rate: -; Height - Seated (Max): 0.014" (0.35mm); Part Status: Active
R146 R147 = Res_0402: Manufacturer: Stackpole Electronics Inc; Manufacturer Part Number 1: RMCF0402FT1K00; Part Description: RES SMD 1K OHM 1% 1/16W 0402; Temperature Coefficient: ±100ppm/°C; Power (Watts): 0.063W, 1/16W; Value: 1k, 1%; Supplier 1: Digi-Key; Supplier Part Number 1: RMCF0402FT1K00TR-ND; Resistance (Ohms): 1k; Packaging: Tape & Reel (TR); Category: Resistors; RoHS: RoHS Compliant; Tolerance: ±1%; Height: 0.016" (0.40mm); Number of Terminations: 2; Package / Case: 0402 (1005 Metric); Operating Temperature: -55°C ~ 155°C; Features: -; Composition: Thick Film; Supplier Device Package: 0402; Size / Dimension: 0.039" L x 0.020" W (1.00mm x 0.50mm)
R152 R157 = Res_0402: Manufacturer Part Number 1: RMCF0402FT249R; Manufacturer: Stackpole Electronics Inc; Part Description: RES SMD 249 OHM 1% 1/16W 0402; Resistance (Ohms): 249; Power (Watts): 0.063W, 1/16W; Temperature Coefficient: ±100ppm/°C; Value: 249R, 1%; Supplier 1: Digi-Key; Supplier Part Number 1: RMCF0402FT249RCT-ND; Package / Case: 0402 (1005 Metric); Features: -; Size / Dimension: 0.039" L x 0.020" W (1.00mm x 0.50mm); Category: Resistors; Operating Temperature: -55°C ~ 155°C; Packaging: Cut Tape (CT); Tolerance: ±1%; Supplier Device Package: 0402; RoHS: RoHS Compliant; Composition: Thick Film; Number of Terminations: 2; Height: 0.016" (0.40mm)
R153 R155 = Res_0402: Manufacturer Part Number 1: RMCF0402FT100R; Manufacturer: Stackpole Electronics Inc.; Part Description: RES SMD 100 OHM 1% 1/16W 0402; Power (Watts): 0.063W, 1/16W; Temperature Coefficient: ±100ppm/°C; Resistance (Ohms): 100; Value: 100R, 1%; Supplier 1: Digi-Key; Supplier Part Number 1: RMCF0402FT100RDKR-ND; Packaging: Digi-Reel®; Composition: Thick Film; Number of Terminations: 2; Package / Case: 0402 (1005 Metric); RoHS: RoHS Compliant; Category: Resistors; Size / Dimension: 0.039" L x 0.020" W (1.00mm x 0.50mm); Tolerance: ±1%; Supplier Device Package: 0402; Features: -; Height: 0.016" (0.40mm); Operating Temperature: -55°C ~ 155°C
R154 R156 = Res_0402: Manufacturer: Stackpole Electronics Inc; Manufacturer Part Number 1: RMCF0402FT2K20; Part Description: RES SMD 2.2K OHM 1% 1/16W 0402; Resistance (Ohms): 2.2k; Temperature Coefficient: ±100ppm/°C; Power (Watts): 0.063W, 1/16W; Value: 2k2, 1%; Supplier 1: Digi-Key; Supplier Part Number 1: RMCF0402FT2K20CT-ND; Supplier Device Package: 0402; Package / Case: 0402 (1005 Metric); Size / Dimension: 0.039" L x 0.020" W (1.00mm x 0.50mm); Operating Temperature: -55°C ~ 155°C; Composition: Thick Film; Category: Resistors; Features: -; Height: 0.016" (0.40mm); RoHS: RoHS Compliant; Number of Terminations: 2; Packaging: Cut Tape (CT); Tolerance: ±1%
R159 = Res_0402: Manufacturer: Yageo; Manufacturer Part Number 1: RC0402FR-0710KL; Part Description: RES SMD 10K OHM 1% 1/16W 0402; Temperature Coefficient: ±100ppm/°C; Power (Watts): 0.063W, 1/16W; Value: 10k, 1%; Supplier 1: Digi-Key; Supplier Part Number 1: 311-10.0KLRTR-ND; Resistance (Ohms): 10k; Packaging: Tape & Reel (TR); RoHS: RoHS Compliant; Package / Case: 0402 (1005 Metric); Tolerance: ±1%; Operating Temperature: -55°C ~ 155°C; Size / Dimension: 0.039" L x 0.020" W (1.00mm x 0.50mm); Number of Terminations: 2; Category: Resistors; Height: 0.016" (0.40mm); Supplier Device Package: 0402; Features: Moisture Resistant; Composition: Thick Film
R160 = Res_0402: Manufacturer Part Number 1: ERJ-2RKF4422X; Manufacturer: Panasonic Electronic Components; Part Description: RES SMD 44.2K OHM 1% 1/10W 0402; Power (Watts): 0.1W, 1/10W; Temperature Coefficient: ±100ppm/°C; Value: 44.2k, 1%; Supplier 1: Digi-Key; Supplier Part Number 1: P44.2KLCT-ND; Tolerance: ±1%; Supplier Device Package: 0402; Packaging: Cut Tape (CT); Size / Dimension: 0.039" L x 0.020" W (1.00mm x 0.50mm); Features: Automotive AEC-Q200; Package / Case: 0402 (1005 Metric); Height: 0.016" (0.40mm); Operating Temperature: -55°C ~ 155°C; Number of Terminations: 2; Composition: Thick Film; Resistance (Ohms): 44.2k; RoHS: RoHS Compliant; Category: Resistors
VD1 = TVS_ESD5384NCTBG: Manufacturer: ON Semiconductor; Part Description: TVS DIODE 3V 9WLCSP; Capacitance: 29pF; Direction: Unidirectional; Number of Unidirectional Channels: 5; Reverse Standoff Voltage: 3V; Min Breakdown Voltage: 6V; Power Line Protection: No; ESD Protection: Yes; Max Reverse Leakage Current: 200nA; Supplier 1: Digi-Key; Manufacturer Part Number 1: ESD5384NCTBG; Stock 1: 4993; Pricing 1: 1=0.47, 10=0.406, 100=0.3028, 500=0.23794, 1000=0.18386 (USD); Number of Pins: 9; Min Operating Temperature: -30°C; Max Operating Temperature: 85°C; Package Quantity: 5000; Packaging: Tape and Reel; Number of Lines: 5; Composition: Zener; Length: 1.14mm; Height: 0.63mm; Width: 1.14mm; Depth: 1.14mm; Radiation Hardening: No; Lead Free: Lead Free; Halogen Free: Halogen Free; Supplier Part Number 1: ESD5384NCTBGOSDKR-ND
VD2 = BAV99WT1G_DUAL_DIODE: Manufacturer: ON Semiconductor; Manufacturer Part Number 1: SBAV99WT1G; Part Description: Diode Array 1 Pair Series Connection Standard 100V 215mA (DC) Surface Mount SC-70, SOT-323; Max Surge Current: 500mA; Recovery Time: 6ns; Forward Current: 715mA; Peak Reverse Current: 2.5uA; Forward Voltage: 1.25V; Element Configuration: Dual; Max Repetitive Reverse Voltage (Vrrm): 70V; Peak Non-Repetitive Surge Current: 2A; Max Reverse Voltage (DC): 100V; Max Power Dissipation: 200mW; Supplier 1: Digi-Key; Stock 1: 1217; Pricing 1: 1=0.32, 10=0.259, 100=0.1375, 500=0.09044, 1000=0.0615 (USD); Case/Package: SOT-323-3; Number of Pins: 3; Min Operating Temperature: -65°C; Max Operating Temperature: 150°C; Package Quantity: 3000; Packaging: Tape and Reel; Average Rectified Current: 715mA; Reverse Recovery Time: 6ns; Max Reverse Leakage Current: 2.5uA; Max Forward Surge Current (Ifsm): 500mA; Length: 2.2mm; Height: 0.9mm; Width: 1.35mm; Radiation Hardening: No; REACH SVHC: No SVHC; Lead Free: Lead Free; Halogen Free: Halogen Free; Supplier Part Number 1: SBAV99WT1GOSCT-ND
VT5-VT7 = DMG1012T: Manufacturer: Diodes Incorporated; Manufacturer Part Number 1: DMG1012TQ-7; Part Description: N-Channel 20V 630mA (Ta) 280mW (Ta) Surface Mount SOT-523; FET Type: N-Channel; Current - Continuous Drain (Id) @ 25°C: 630mA (Ta); Drive Voltage (Max Rds On,  Min Rds On): 1.8V, 4.5V; Rds On (Max) @ Id, Vgs: 400 mOhm @ 600mA, 4.5V; Vgs(th) (Max) @ Id: 1V @ 250µA; Vgs (Max): ±6V; Power Dissipation (Max): 280mW (Ta); Supplier 1: Digi-Key; RoHS: RoHS Compliant; Category: Discrete Semiconductor Products; Stock 1: 3569; Pricing 1: 1=0.47, 10=0.424, 100=0.2375, 500=0.12722, 1000=0.08651 (USD); Packaging: Cut Tape (CT); Part Status: Active; Technology: MOSFET (Metal Oxide); FET Feature: -; Operating Temperature: -55°C ~ 150°C (TJ); Mounting Type: Surface Mount; Supplier Device Package: SOT-523; Package / Case: SOT-523; ComponentLink1URL: https://www.diodes.com/assets/Datasheets/ds31783.pdf; ComponentLink1Description: https://www.diodes.com/assets/Datasheets/ds31783.pdf; Supplier Part Number 1: DMG1012TQ-7DICT-ND